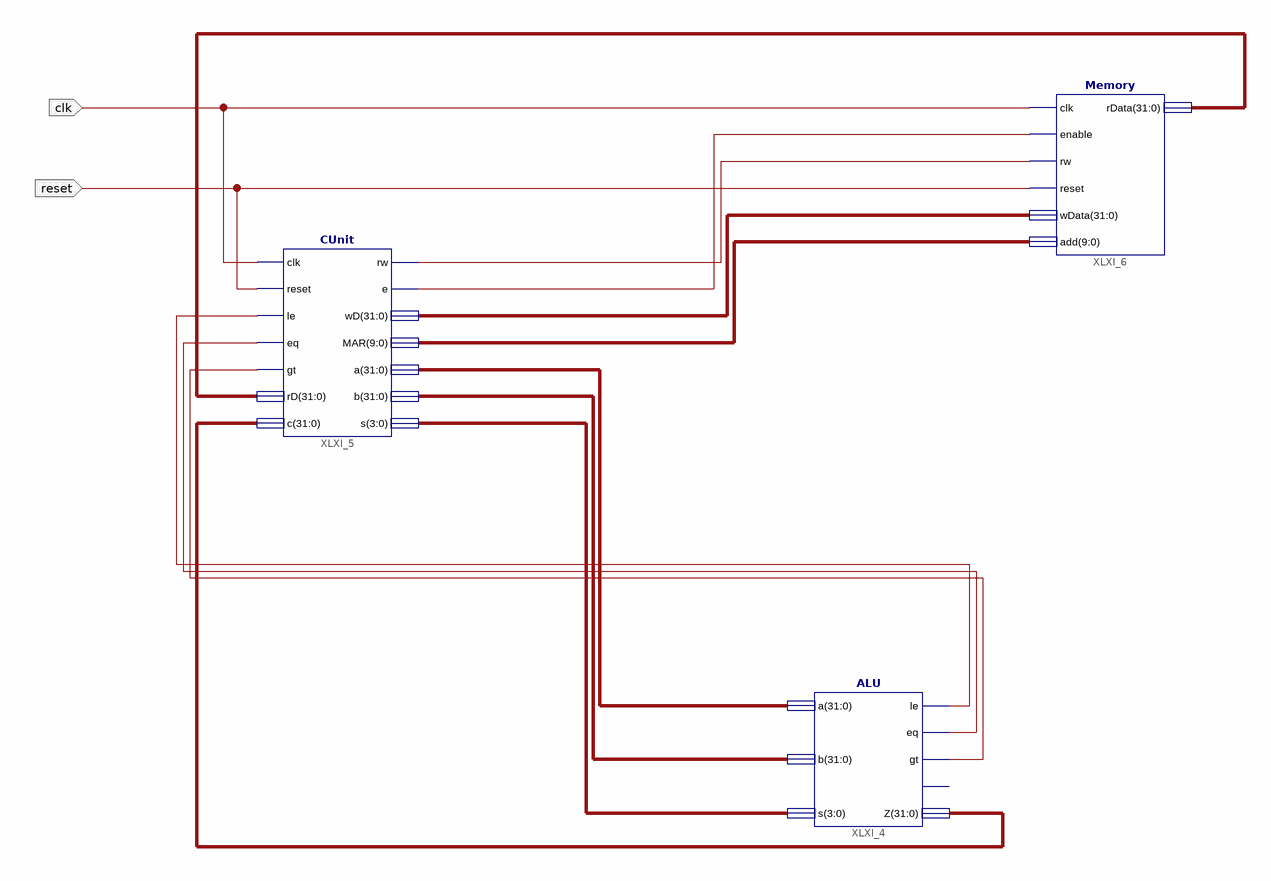
[diagram p0: schematic sheet 1]
// Xilinx ISE schematic Architecture_schematic.sch (spartan6) as structural Verilog: 3 symbols, 2 ports
module Architecture_schematic (
  input  clk,
  input  reset
);

  wire XLXN_31, XLXN_32, XLXN_41, XLXN_42, XLXN_43;
  wire [3:0] XLXN_37;
  wire [9:0] XLXN_34;
  wire [31:0] XLXN_33, XLXN_35, XLXN_36, XLXN_38, XLXN_40;

  CUnit XLXI_5 (
    .clk(clk), .reset(reset), .le(XLXN_41), .eq(XLXN_42), .gt(XLXN_43), .rD(XLXN_38), .c(XLXN_40),
    .rw(XLXN_31), .e(XLXN_32), .wD(XLXN_33), .MAR(XLXN_34), .a(XLXN_35), .b(XLXN_36), .s(XLXN_37));
  ALU XLXI_4 (
    .a(XLXN_35), .b(XLXN_36), .s(XLXN_37), .le(XLXN_41), .eq(XLXN_42), .gt(XLXN_43), .Z(XLXN_40));  // open: ovf
  Memory XLXI_6 (
    .clk(clk), .enable(XLXN_32), .rw(XLXN_31), .reset(reset), .wData(XLXN_33), .add(XLXN_34), .rData(XLXN_38));
endmodule
